# Altium schematic sheet RaspberryPi.SchDoc
size Tabloid; DocumentNumber: 1; SheetNumber: 1; SheetTotal: 2
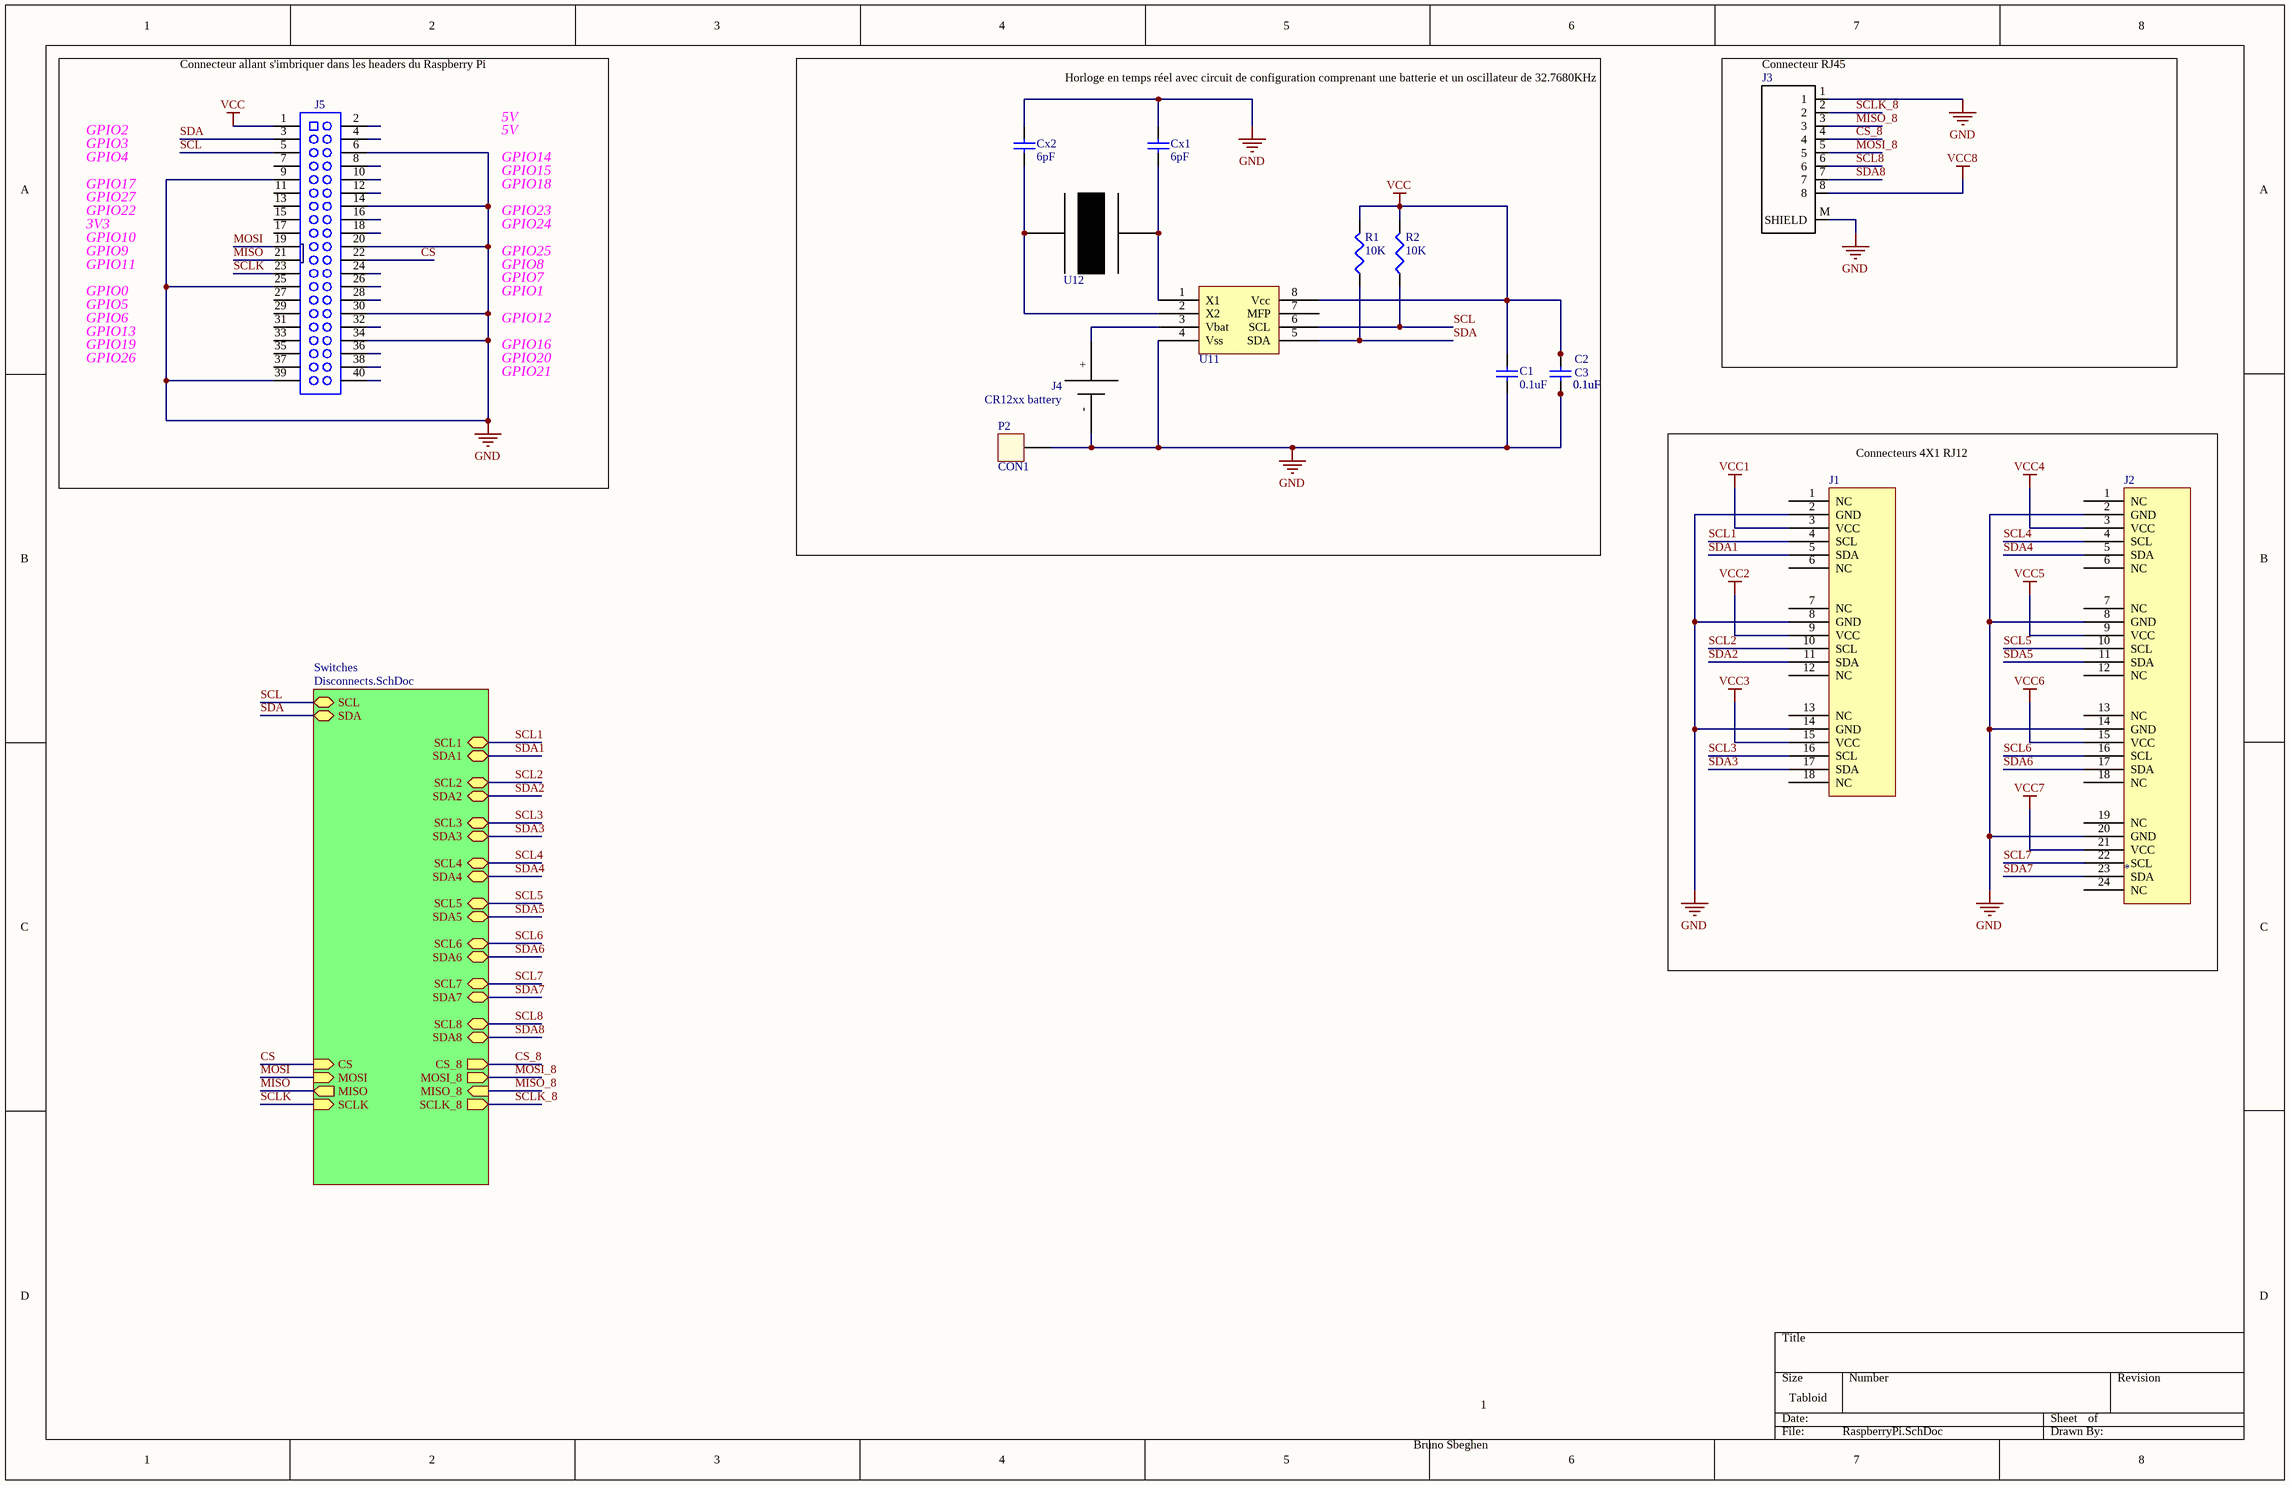
[diagram p0: RaspberryPi.SchDoc]

## Parts
C1  value 0.1uF  [C0805]  (hidden comment: Cap 0.1uF)
C2  value 0.1uF  [C0805]  (hidden comment: Cap 0.1uF)
C3  value 0.1uF  [C0805]  (hidden comment: Cap 0.1uF)
Cx1  value 6pF  [C0805]  (hidden comment: Cap 6pF)
Cx2  value 6pF  [C0805]  (hidden comment: Cap 6pF)
J1  TM2RE-1818(50)  [TM2RE-1818]  (value not drawn)
J2  *  [TM2RE-2424]
J3  TM3RA-88(50)  [TM3RA-88(50)]  (value not drawn)
J4  CR12xx battery  [BS-1225-PC]
J5  ??  [CONN40_100mils_M20_7812045]  (value not drawn)
P2  CON1  [CONN1_100mils]  (no BOM)
R1  value 10K  [6-0805_N]  (hidden comment: Res 10K)
R2  value 10K  [6-0805_N]  (hidden comment: Res 10K)
U11  *  [MCP79410]  (value not drawn)
U12  *  [ECX-31B]  (value not drawn)

## Blocks framed on the sheet
Connecteur RJ45: J3
Connecteurs 4X1 RJ12: J1 J2

## Sub-sheets
Switches = Disconnects.SchDoc: SCL1 (bidir), SDA1 (bidir), SCL2 (bidir), SDA2 (bidir), SCL3 (bidir), SDA3 (bidir), SCL4 (bidir), SDA4 (bidir), SCL5 (bidir), SDA5 (bidir), SCL6 (bidir), SDA6 (bidir), SCL7 (bidir), SDA (bidir), SCL (bidir), SDA7 (bidir), SCLK_8 (out), SDA8 (bidir), MISO (out), MOSI (in), SCL8 (bidir), CS (in), SCLK (in), CS_8 (out), MOSI_8 (out), MISO_8 (in)

## Nets
GND: C1.1 C2.1 C3.1 Cx1.2 Cx2.2 J1.2(GND) J1.8(GND) J1.14(GND) J2.2(GND) J2.8(GND) J2.14(GND) J2.20(GND) J3.1 J3.M(SHIELD) J4.- J5.6 J5.9 J5.14 J5.20 J5.25 J5.30 J5.34 J5.39 P2.1 U11.4(Vss)
VCC: C1.2 C2.2 C3.2 J5.1 R1.2 R2.2 U11.8(Vcc)
VCC1: J1.3(VCC)
VCC2: J1.9(VCC)
VCC3: J1.15(VCC)
VCC4: J2.3(VCC)
VCC5: J2.9(VCC)
VCC6: J2.15(VCC)
VCC7: J2.21(VCC)
VCC8: J3.8
CS: J5.22 ; sheet Switches/CS
CS_8: J3.4 ; sheet Switches/CS_8
MISO: J5.21 ; sheet Switches/MISO
MISO_8: J3.3 ; sheet Switches/MISO_8
MOSI: J5.19 ; sheet Switches/MOSI
MOSI_8: J3.5 ; sheet Switches/MOSI_8
SCL: J5.5 R2.1 U11.6(SCL) ; sheet Switches/SCL
SCL1: J1.4(SCL) ; sheet Switches/SCL1
SCL2: J1.10(SCL) ; sheet Switches/SCL2
SCL3: J1.16(SCL) ; sheet Switches/SCL3
SCL4: J2.4(SCL) ; sheet Switches/SCL4
SCL5: J2.10(SCL) ; sheet Switches/SCL5
SCL6: J2.16(SCL) ; sheet Switches/SCL6
SCL7: J2.22(SCL) ; sheet Switches/SCL7
SCL8: J3.6 ; sheet Switches/SCL8
SCLK: J5.23 ; sheet Switches/SCLK
SCLK_8: J3.2 ; sheet Switches/SCLK_8
SDA: J5.3 R1.1 U11.5(SDA) ; sheet Switches/SDA
SDA1: J1.5(SDA) ; sheet Switches/SDA1
SDA2: J1.11(SDA) ; sheet Switches/SDA2
SDA3: J1.17(SDA) ; sheet Switches/SDA3
SDA4: J2.5(SDA) ; sheet Switches/SDA4
SDA5: J2.11(SDA) ; sheet Switches/SDA5
SDA6: J2.17(SDA) ; sheet Switches/SDA6
SDA7: J2.23(SDA) ; sheet Switches/SDA7
SDA8: J3.7 ; sheet Switches/SDA8
NetCx1_1: Cx1.1 U11.1(X1) U12.2
NetCx2_1: Cx2.1 U11.2(X2) U12.1
NetJ4_+: J4.+ U11.3(Vbat)

Not connected (* = marked no-connect by the designer): J1 1(NC) 6(NC) 7(NC) 12(NC) 13(NC) 18(NC); J2 1(NC) 6(NC) 7(NC) 12(NC) 13(NC) 18(NC) 19(NC) 24(NC); J5 2 4 7 8 10 11 12 13 15 16 17 18 24 26 27 28 29 31 32 33 35 36 37 38 40; U11 7(MFP)

## Notes on the sheet
- Connecteur allant s'imbriquer dans les headers du Raspberry Pi
- Horloge en temps réel avec circuit de configuration comprenant une batterie et un oscillateur de 32.7680KHz
- GPIO2
- GPIO3
- GPIO4
- 5V
- GPIO14
- GPIO17
- GPIO22
- GPIO27
- 3V3
- GPIO15
- GPIO18
- GPIO23
- GPIO24
- GPIO9
- GPIO10
- GPIO11
- GPIO0
- GPIO25
- GPIO7
- GPIO8
- GPIO1
- GPIO19
- GPIO26
- GPIO5
- GPIO6
- GPIO13
- GPIO16
- GPIO20
- GPIO12
- GPIO21
- 1
- Bruno Sbeghen

## Library data of the parts
C1-C3 = Cap 0.1uF: Capacitor 0.1uF; Published: 8-Jun-2000; LatestRevisionDate: 29-May-2009; LatestRevisionNote: IPC-7351 Footprint Added.; PackageReference: C1206; Publisher: Altium Limited; PackageDescription: Chip Capacitor; Supplier 1: Digi-Key; Supplier1_PN: 478-1395-1-ND
Cx1 Cx2 = Cap 6pF: Capacitor 6pF; Published: 8-Jun-2000; LatestRevisionDate: 29-May-2009; LatestRevisionNote: IPC-7351 Footprint Added.; PackageReference: C1206; Publisher: Altium Limited; PackageDescription: Chip Capacitor; Supplier 1: Digi-Key; Supplier1_PN: 1276-1767-1-ND
J1 = TM2RE-1818(50): Connector MOD JACK 3pos; Supplier 1: Digi-Key; Supplier1_PN: H11272-ND
J2 = TM2RE-2424(50): Connector MOD JACK 4pos; Supplier 1: Digi-Key; Supplier1_PN: H11267-ND
J3 = TM3RA-88(50): Signal Line; Modular; 8 Contacts; 1 Port Through Hole Vertical; MF: Hirose; SnapEDA_Link: *; Price: *; Package: None; MP: TM3RA-88(50); Availability: Good; Value: *; Supplier 1: Digi-Key; Supplier1_PN: H11279-ND
J4 = CONN_BATT_12mm_VERTICAL: 12mm Battery holder; Supplier 1: Digi-Key; Supplier1_PN: BS-1225-PC-ND
J5 = CON40_2x20: IDC Boxed Header, Straight, PCB Mount, Polarised, 40 Way, 2x20, 0.1" Pitch; Mfg: Harwin; Mfg_PN: M20-7812045; Supplier1: Digikey; Supplier1_PN: 952-3218-ND
P2 = CON1: TP; HelpURL: *; Mfg: *; Mfg_PN: *; NI: *; Rating: *; Supplier1: *; Supplier1_PN: *; Tolerance: *; Type: *; Value: *
R1 R2 = Res 10K: Resistor 10K; Published: 8-Jun-2000; LatestRevisionDate: 29-May-2009; LatestRevisionNote: IPC-7351 Footprint Added.; PackageReference: J1-0603; Publisher: Altium Limited; PackageDescription: Chip Resistor; Supplier 1: Digi-Key; Supplier1_PN: 311-10.0KCRCT-ND
U11 = MCP79410: RTC; Supplier 1: Digi-Key; Supplier1_PN: MCP79410T-I/SNCT-ND
U12 = AB38T: Oscillator 32.7680KHz; Supplier 1: Digi-Key; Supplier1_PN: 535-11937-1-ND